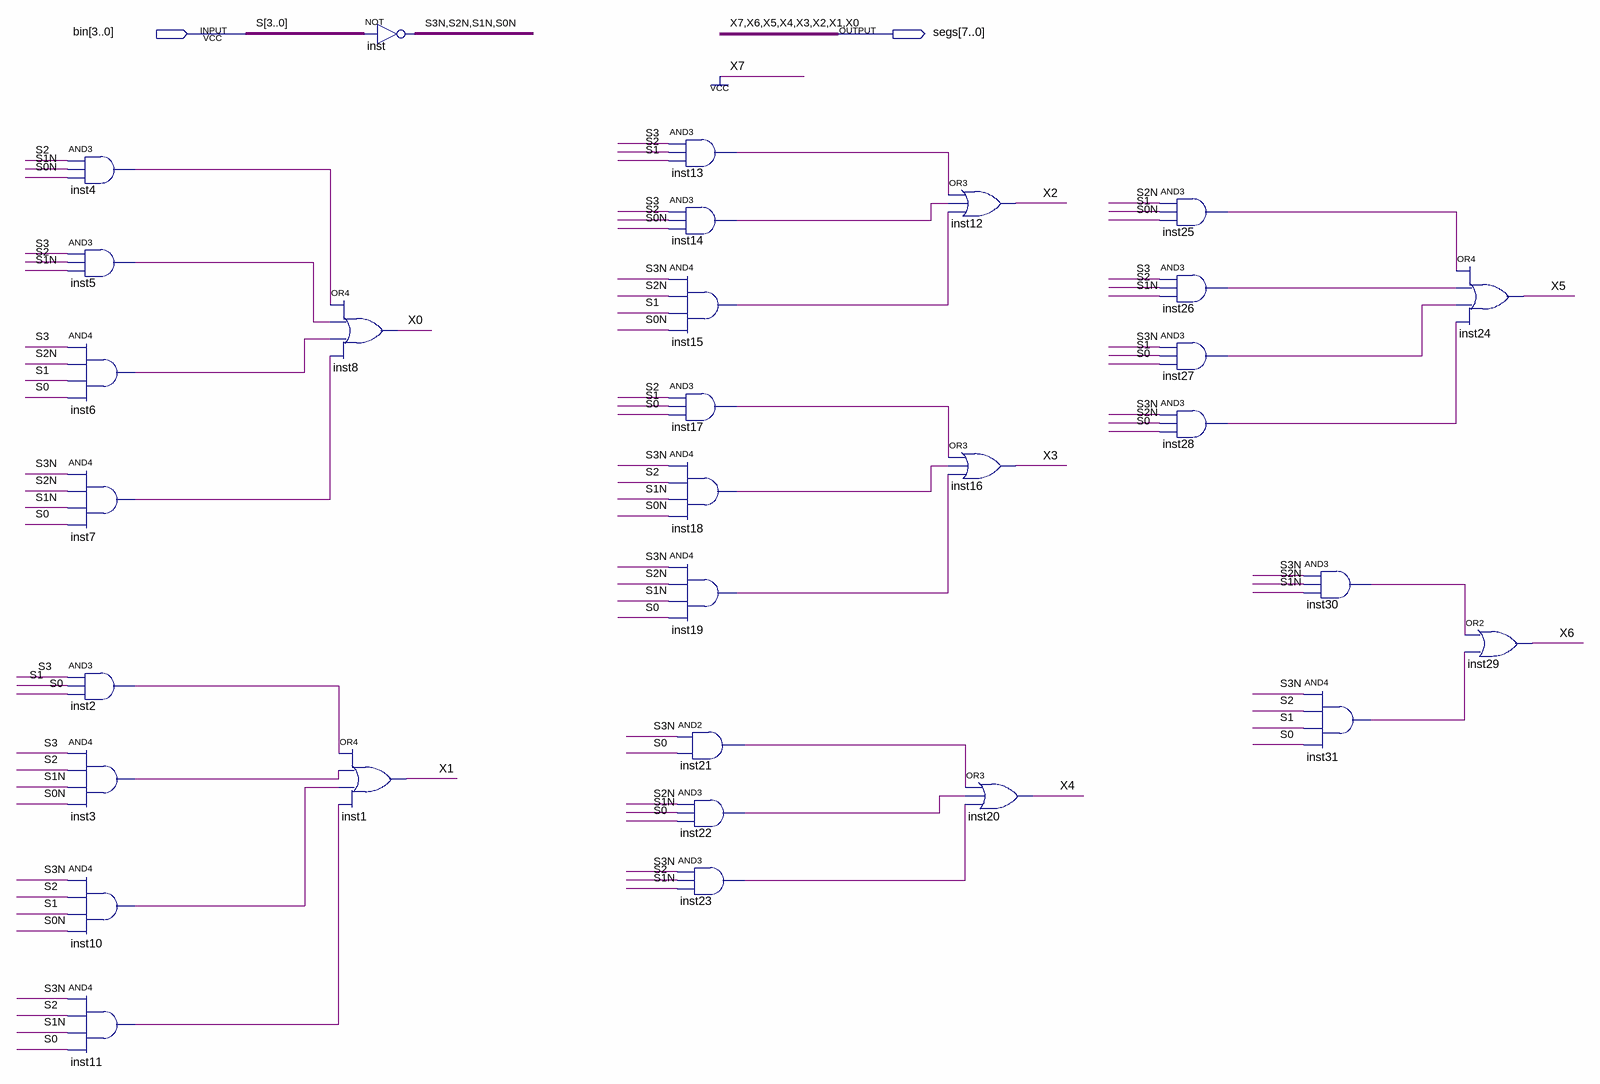
[diagram p0: schematic sheet]
// Quartus schematic bin2hex.bdf as structural Verilog: 31 symbols, 2 pins
module bin2hex (
  input  [3:0] bin,
  output [7:0] segs
);

  wire inst2_out, inst3_out, inst4_out, inst5_out, inst6_out, inst7_out, inst10_out, inst11_out, inst13_out,
       inst14_out, inst15_out, inst17_out, inst18_out, inst19_out, inst21_out, inst22_out, inst23_out,
       inst25_out, inst26_out, inst27_out, inst28_out, inst30_out, inst31_out, S0N, S1N, S2N, S3N;

  and inst4 (inst4_out, bin[2], S1N, S0N);
  and inst5 (inst5_out, bin[3], bin[2], S1N);
  and inst6 (inst6_out, bin[3], S2N, bin[1], bin[0]);
  and inst7 (inst7_out, S3N, S2N, S1N, bin[0]);
  and inst2 (inst2_out, bin[3], bin[1], bin[0]);
  and inst3 (inst3_out, bin[3], bin[2], S1N, S0N);
  and inst10 (inst10_out, S3N, bin[2], bin[1], S0N);
  and inst11 (inst11_out, S3N, bin[2], S1N, bin[0]);
  assign {S3N, S2N, S1N, S0N} = ~bin;  // NOT inst, 4 bits wide
  or inst8 (segs[0], inst4_out, inst5_out, inst6_out, inst7_out);
  or inst1 (segs[1], inst2_out, inst3_out, inst10_out, inst11_out);
  and inst13 (inst13_out, bin[3], bin[2], bin[1]);
  and inst14 (inst14_out, bin[3], bin[2], S0N);
  and inst15 (inst15_out, S3N, S2N, bin[1], S0N);
  and inst17 (inst17_out, bin[2], bin[1], bin[0]);
  and inst18 (inst18_out, S3N, bin[2], S1N, S0N);
  and inst19 (inst19_out, S3N, S2N, S1N, bin[0]);
  and inst21 (inst21_out, S3N, bin[0]);
  and inst22 (inst22_out, S2N, S1N, bin[0]);
  and inst23 (inst23_out, S3N, bin[2], S1N);
  or inst12 (segs[2], inst13_out, inst14_out, inst15_out);
  or inst16 (segs[3], inst17_out, inst18_out, inst19_out);
  or inst20 (segs[4], inst21_out, inst22_out, inst23_out);
  and inst25 (inst25_out, S2N, bin[1], S0N);
  and inst26 (inst26_out, bin[3], bin[2], S1N);
  and inst27 (inst27_out, S3N, bin[1], bin[0]);
  and inst28 (inst28_out, S3N, S2N, bin[0]);
  and inst30 (inst30_out, S3N, S2N, S1N);
  and inst31 (inst31_out, S3N, bin[2], bin[1], bin[0]);
  or inst24 (segs[5], inst25_out, inst26_out, inst27_out, inst28_out);
  or inst29 (segs[6], inst30_out, inst31_out);

  assign segs[7] = 1'b1;

  // Other names for the same wires on the sheet: S[3:0] = bin; S0 = bin[0]; S1 = bin[1]; S2 = bin[2]; S3 = bin[3];
  //   X0 = segs[0]; X1 = segs[1]; X2 = segs[2]; X3 = segs[3]; X4 = segs[4]; X5 = segs[5]; X6 = segs[6]
endmodule
